# Altium project High power brushded DC MC.PrjPcb
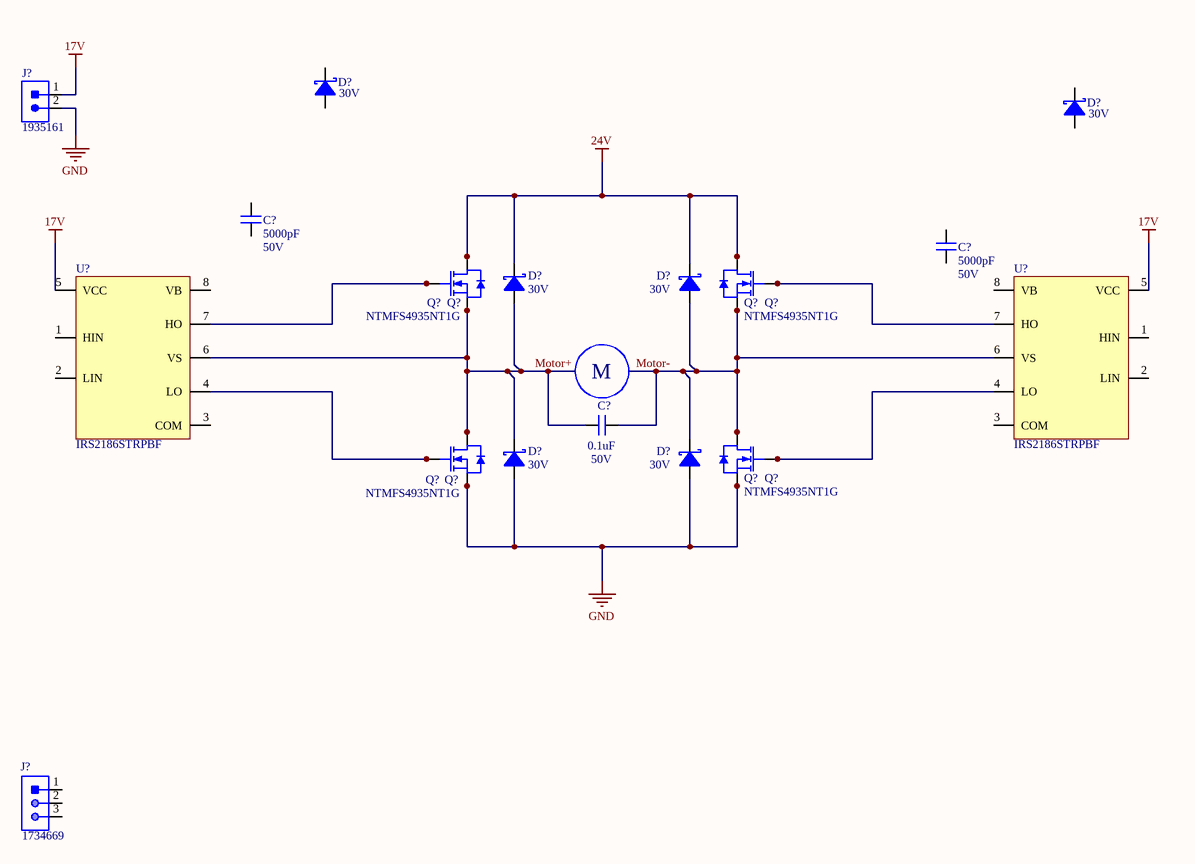
[diagram p0: H-bridge and gate drivers.SchDoc]
1 sheet, 21 parts. Net scope: global (net labels, ports and power ports of the same name join across sheets).

## Sheet H-bridge and gate drivers.SchDoc: H-bridge and gate drivers
size Letter; DrawnBy: K Hong; SheetNumber: 1; SheetTotal: 1

### Parts
(Parts that share a designator on the sheet are numbered #1, #2 ... from top to bottom, then left to right.)
C?#1  Capacitance: 5000pF  Voltage Rating (DC): 50V  [CAPC1206(3216)]  (hidden comment: CAP_5000pF_50V_1206)
C?#2  Capacitance: 5000pF  Voltage Rating (DC): 50V  [CAPC1206(3216)]  (hidden comment: CAP_5000pF_50V_1206)
C?#3  value 0.1uF  Voltage Rating: 50V  [CAPC2012X140N]  (hidden comment: CAP_0.1uF_50V_0805)
D?#1  Vr (Max): 30V  [DIO_CUS520,H3F]  (hidden comment: DIO_SCHOTTKY_30V_800mA)
D?#2  Vr (Max): 30V  [DIO_CUS520,H3F]  (hidden comment: DIO_SCHOTTKY_30V_800mA)
D?#3  Vr (Max): 30V  [DIO_CUS520,H3F]  (hidden comment: DIO_SCHOTTKY_30V_800mA)
D?#4  Vr (Max): 30V  [DIO_CUS520,H3F]  (hidden comment: DIO_SCHOTTKY_30V_800mA)
D?#5  Vr (Max): 30V  [DIO_CUS520,H3F]  (hidden comment: DIO_SCHOTTKY_30V_800mA)
D?#6  Vr (Max): 30V  [DIO_CUS520,H3F]  (hidden comment: DIO_SCHOTTKY_30V_800mA)
J?#1  CON_2M_TERM  [1935161]  (value not drawn)
J?#2  Manufacturer Part Number 1: 1734669  [3 PIN TERM]  (hidden comment: CON_3M_TERM)
Q?#1  NTMFS4935NT1G  [SO8-FL]
Q?#2  NTMFS4935NT1G  [SO8-FL]  (value not drawn)
Q?#3  NTMFS4935NT1G  [SO8-FL]
Q?#4  NTMFS4935NT1G  [SO8-FL]  (value not drawn)
Q?#5  NTMFS4935NT1G  [SO8-FL]  (value not drawn)
Q?#6  NTMFS4935NT1G  [SO8-FL]
Q?#7  NTMFS4935NT1G  [SO8-FL]  (value not drawn)
Q?#8  NTMFS4935NT1G  [SO8-FL]
U?#1  IRS2186STRPBF  [8-SOIC_M]
U?#2  IRS2186STRPBF  [8-SOIC_M]

### Nets
17V: J?#1.1 U?#1.5(VCC) U?#2.5(VCC)
24V: D?#3.2(Cathode) D?#4.2(Cathode) Q?#1.3(Drain) Q?#2.3(Drain) Q?#3.3(Drain) Q?#4.3(Drain)
GND: D?#5.1(Anode) D?#6.1(Anode) J?#1.2 Q?#5.1(Source) Q?#6.1(Source) Q?#7.1(Source) Q?#8.1(Source)
Motor+: C?#3.1 D?#3.1(Anode) D?#5.2(Cathode) Q?#1.1(Source) Q?#2.1(Source) Q?#5.3(Drain) Q?#6.3(Drain) U?#1.6(VS)
Motor-: C?#3.2 D?#4.1(Anode) D?#6.2(Cathode) Q?#3.1(Source) Q?#4.1(Source) Q?#7.3(Drain) Q?#8.3(Drain) U?#2.6(VS)
NetQ?#1_2: Q?#1.2(Gate) Q?#2.2(Gate) U?#1.7(HO)
NetQ?#3_2: Q?#3.2(Gate) Q?#4.2(Gate) U?#2.7(HO)
NetQ?#5_2: Q?#5.2(Gate) Q?#6.2(Gate) U?#1.4(LO)
NetQ?#7_2: Q?#7.2(Gate) Q?#8.2(Gate) U?#2.4(LO)

Not connected (* = marked no-connect by the designer): C?#1 1 2; C?#2 1 2; D?#1 1(Anode) 2(Cathode); D?#2 1(Anode) 2(Cathode); J?#2 1 2 3; U?#1 1(HIN) 2(LIN) 3(COM) 8(VB); U?#2 1(HIN) 2(LIN) 3(COM) 8(VB)

### Notes on the sheet
- (near C?#3) M
- Title
- Size:
- Date:
- Letter
- Drawn By:
- Sheet
- of
- File:

### Library data of the parts
C?#1 C?#2 = CAP_5000pF_50V_1206: CAP CER 5000pF 50V X7R 1206; Manufacturer 1: Kyocera AVX; Manufacturer Part Number 1: 12065C502JAT2A; Dissipation Factor: 2.5%; Tolerance: 5%; Supplier 1: Digi-Key; RoHS: Yes; Category: Ceramic Capacitors; Stock 1: 12333; Pricing 1: 1=0.34000, 10=0.23500, 100=0.13330, 500=0.09412, 1000=0.08235 (USD); Mount: Surface Mount; Case/Package: 1206; Number of Pins: 2; Case Code (Metric): 3216; Case Code (Imperial): 1206; Min Operating Temperature: -55°C; Max Operating Temperature: 125°C; Package Quantity: 4000; Voltage Rating: 50V; Packaging: Tape and Reel; Dielectric: X7R; Termination: SMD/SMT; Length: 3.2mm; Width: 0.063inch; Thickness: 0.037inch; Depth: 1.6mm; Radiation Hardening: No; ComponentLink1URL: https://datasheet.ciiva.com/206/cx7r-206289.pdf?src-supplier=Digi-Key; ComponentLink1Description: https://datasheet.ciiva.com/206/cx7r-206289.pdf?src-supplier=Digi-Key; Supplier Part Number 1: 478-11953-1-ND
C?#3 = CAP_0.1uF_50V_0805: CAP CER 0.1UF 50V X7R 0805; Manufacturer 1: Murata Electronics; Manufacturer Part Number 1: GCD21BR71H104KA01L; Capacitance: 100nF; Tolerance: 10%; Mount: Surface Mount; Case/Package: 0805; Case Code (Metric): 2012; Case Code (Imperial): 0805; Min Operating Temperature: -55°C; Max Operating Temperature: 125°C; Dielectric: X7R; Termination: SMD/SMT; Length: 2mm; Height: 1.25mm; Width: 0.049inch; Thickness: 0.049inch; Depth: 1.25mm; Ratings: AEC-Q200; ComponentLink1URL: https://datasheet.ciiva.com/29537/c03e-29537701.pdf?src-supplier=Digi-Key; ComponentLink1Description: https://datasheet.ciiva.com/29537/c03e-29537701.pdf?src-supplier=Digi-Key; Supplier 1: Digi-Key; Supplier Part Number 1: 490-11955-1-ND
D?#1-D?#6 = DIO_SCHOTTKY_30V_800mA: DIODE SCHOTTKY 30V 800MA USC; Manufacturer 1: Toshiba Semiconductor and Storage; Manufacturer Part Number 1: CUS08F30,H3F; Vf (Max): 220mV; Supplier 1: Digi-Key; Supplier Part Number 1: CUS08F30H3FCT-ND; Mount: Surface Mount; Io: 800mA
J?#1 = CON_2M_TERM: TERM BLK 2POS SIDE ENTRY 5MM; Manufacturer 1: Phoenix Contact; Connector Type: Screw; Voltage Rating (DC): 320V; Max Current Rating: 16A; Max Supply Voltage: 250V; Current Rating: 17.5A; Number of Poles: 2; Number of Levels: 1; Current: 18A; Voltage: 300V; Wire Gauge (Max): 26AWG; Wire Gauge (Min): 12AWG; Approvals: UL; Supplier 1: Digi-Key; Manufacturer Part Number 1: 1935161; Stock 1: 15494; Pricing 1: 1=0.43000, 10=0.41100, 50=0.39280, 100=0.38200, 250=0.35700, 500=0.32844, 1000=0.30350 (USD); RoHS: Yes; Mount: Through Hole; Number of Pins: 2; Weight: 0.067021oz; Contact Material: Copper,Tin; Insulation Material: Nylon; Housing Material: Polyamide; Housing Color: Green; Color: Green; Material: Nylon; Number of Rows: 1; Voltage Rating: 250V; Package Quantity: 250; Packaging: Bulk; Number of Positions: 2; Number of Positions Per Level: 2; Termination: Solder; Number of Contacts: 2; Number of Circuits: 2; Orientation: Straight; Length: 9mm; Height: 11.3mm; Width: 14.9mm; Pitch: 5mm; Depth: 9mm; Wire/Cable Gauge: 26AWG; Radiation Hardening: No; Flammability Rating: UL94 V-0; Lead Free: Lead Free; REACH SVHC: Unknown; ComponentLink1URL: https://datasheet.ciiva.com/15169/getdatasheetpartid-177903-15169663.pdf?src-supplier=Verical; ComponentLink1Description: https://datasheet.ciiva.com/15169/getdatasheetpartid-177903-15169663.pdf?src-supplier=Verical; ComponentLink2URL: https://datasheet.ciiva.com/16047/1935161-16047247.pdf?src-supplier=Onlinecomponents.com; ComponentLink2Description: https://datasheet.ciiva.com/16047/1935161-16047247.pdf?src-supplier=Onlinecomponents.com; ComponentLink3URL: https://datasheet.ciiva.com/824/combiconcompact5-0mmseries-824222.pdf?src-supplier=Digi-Key; ComponentLink3Description: https://datasheet.ciiva.com/824/combiconcompact5-0mmseries-824222.pdf?src-supplier=Digi-Key; Supplier Part Number 1: 277-1667-ND
J?#2 = CON_3M_TERM: TERM BLK 3POS SIDE ENTRY 5MM PCB; Manufacturer 1: Phoenix Contact; Supplier 1: Digi-Key; Supplier Part Number 1: 277-1980-ND; Mount: Thru Hole
Q?#1-Q?#8 = NTMFS4935NT1G: MOSFET N-CH 30V 13A SO8FL; Manufacturer 1: ON Semiconductor; Continuous Drain Current (ID): 93A; Drain to Source Resistance: 3.2mR; Power Dissipation: 2.63W; Max Power Dissipation: 48W; Threshold Voltage: 1.63V; Turn-On Delay Time: 16.3ns; Turn-Off Delay Time: 27.5ns; Fall Time: 6.6ns; Number of Elements: 1; Input Capacitance: 4.85nF; Rise Time: 20ns; Element Configuration: Single; Gate to Source Voltage (Vgs): 20V; Supplier 1: Digi-Key; RoHS: Yes; Category: MOSFETs; Stock 1: 10192; Pricing 1: 1=0.87000, 10=0.76800, 25=0.72160, 100=0.52380, 250=0.50516, 500=0.43766 (USD); Case/Package: SO; Number of Pins: 5; Contact Plating: Tin,Matte; Min Operating Temperature: -55°C; Max Operating Temperature: 150°C; Drain to Source Breakdown Voltage: 30V; Drain to Source Voltage (Vdss): 30V; Nominal Vgs: 1.63V; Package Quantity: 1; Rds On Max: 3.2mR; Packaging: Tape and Reel; Length: 5.1mm; Height: 1.1mm; Width: 6.1mm; Radiation Hardening: No; Lead Free: Lead Free; REACH SVHC: No SVHC; ComponentLink1URL: https://datasheet.ciiva.com:443/pdfs/VipMasterIC/IC/ONSM/ONSM-S-A0008367025/ONSM-S-A0008367025-1.pdf?src-supplier=IHS+Markit; ComponentLink1Description: https://datasheet.ciiva.com:443/pdfs/VipMasterIC/IC/ONSM/ONSM-S-A0008367025/ONSM-S-A0008367025-1.pdf?src-supplier=IHS+Markit; ComponentLink2URL: https://datasheet.ciiva.com/22641/1707323-22641681.pdf?src-supplier=Element14; ComponentLink2Description: https://datasheet.ciiva.com/22641/1707323-22641681.pdf?src-supplier=Element14; ComponentLink3URL: https://datasheet.ciiva.com/947/ntmfs4935n-d-947308.pdf?src-supplier=Digi-Key; ComponentLink3Description: https://datasheet.ciiva.com/947/ntmfs4935n-d-947308.pdf?src-supplier=Digi-Key; ComponentLink4URL: https://datasheet.ciiva.com/11166/ntmfs4935n-d-11166461.pdf?src-supplier=Avnet; ComponentLink4Description: https://datasheet.ciiva.com/11166/ntmfs4935n-d-11166461.pdf?src-supplier=Avnet; ComponentLink5URL: https://datasheet.ciiva.com/947/ntmfs4935n-d-947310.pdf?src-supplier=Digi-Key; ComponentLink5Description: https://datasheet.ciiva.com/947/ntmfs4935n-d-947310.pdf?src-supplier=Digi-Key; ComponentLink6URL: https://datasheet.ciiva.com/947/ntmfs4935n-d-947309.pdf?src-supplier=Digi-Key; ComponentLink6Description: https://datasheet.ciiva.com/947/ntmfs4935n-d-947309.pdf?src-supplier=Digi-Key; Supplier Part Number 1: NTMFS4935NT1GOSCT-ND
  Q?#1 Q?#3 Q?#6 Q?#8: Manufacturer Part Number 1: NTMFS4935NT1G
U?#1 U?#2 = IRS2186STRPBF: IC DRIVER HI/LO SIDE 600V 8-SOIC; Manufacturer 1: International Rectifier; Max Supply Current: 240uA; Number of Outputs: 2; Max Supply Voltage: 20V; Min Supply Voltage: 10V; Max Power Dissipation: 625mW; Fall Time: 30ns; Turn-Off Delay Time: 170ns; Rise Time: 38ns; Propagation Delay: 250ns; Max Output Current: 4A; Supplier 1: Digi-Key; RoHS: Yes; Category: Gate Drivers; Stock 1: 2450; Pricing 1: 1=1.50000, 10=1.35000, 25=1.27400, 100=1.01920, 250=0.89180, 500=0.86632, 1000=0.68796 (USD); Mount: Surface Mount; Case/Package: SOIC; Number of Pins: 8; Min Operating Temperature: -40°C; Max Operating Temperature: 125°C; Number of Drivers: 2; Turn-On Delay Time: 170ns; Power Dissipation: 625mW; Package Quantity: 1; Packaging: Tape and Reel; Output Current: 4A; Nominal Supply Current: 240uA; Radiation Hardening: No; Lead Free: Lead Free; ComponentLink1URL: https://datasheet.ciiva.com:443/pdfs/VipMasterIC/IC/IRSD/IRSD-S-A0000774532/IRSD-S-A0000774532-1.pdf?src-supplier=IHS+Markit; ComponentLink1Description: https://datasheet.ciiva.com:443/pdfs/VipMasterIC/IC/IRSD/IRSD-S-A0000774532/IRSD-S-A0000774532-1.pdf?src-supplier=IHS+Markit; ComponentLink2URL: https://datasheet.ciiva.com/1952/irs2186pbf-1952608.pdf?src-supplier=Digi-Key; ComponentLink2Description: https://datasheet.ciiva.com/1952/irs2186pbf-1952608.pdf?src-supplier=Digi-Key; ComponentLink3URL: https://datasheet.ciiva.com/16442/irs2186pbf-16442422.pdf?src-supplier=Future+Electronics; ComponentLink3Description: https://datasheet.ciiva.com/16442/irs2186pbf-16442422.pdf?src-supplier=Future+Electronics; ComponentLink4URL: https://datasheet.ciiva.com/1952/irs2186pbf-1952607.pdf?src-supplier=Digi-Key; ComponentLink4Description: https://datasheet.ciiva.com/1952/irs2186pbf-1952607.pdf?src-supplier=Digi-Key; Supplier Part Number 1: IRS2186STRPBFCT-ND; Manufacturer Part Number 1: IRS2186STRPBF